# Altium schematic sheet Sheet3.SchDoc: Наименование
size 420 x 297 mm; ApprovedBy: Утвердил; CheckedBy: Проверил; Author: Разработал; CompanyName: Организация; DrawnBy: Н.Контр; Engineer: Т.Контр; SheetNumber: 1; SheetTotal: 1; PageSetup: Record=PageOptions|CenterHorizontal=True|CenterVertical=True|PrintScale=0.94|XCorrection=1.00|YCorrection=1.00|PrintKind=1|BorderSize=5000000|LeftOffset=0|BottomOffset=0|Orientation=1|PaperLength=1000|PaperWidth=1000|Scale=100|PaperSource=7|PrintQuality=-4|MediaType=1|DitherType=10|PaperKind=A4|PrintScaleMode=1; DecimalNumber: Децимальный номер; HeadOfSector: Нач. сектора; MainDevice: Перв.примен.; Name: Наименование; DocumentName: Sheet1.SCHDOC
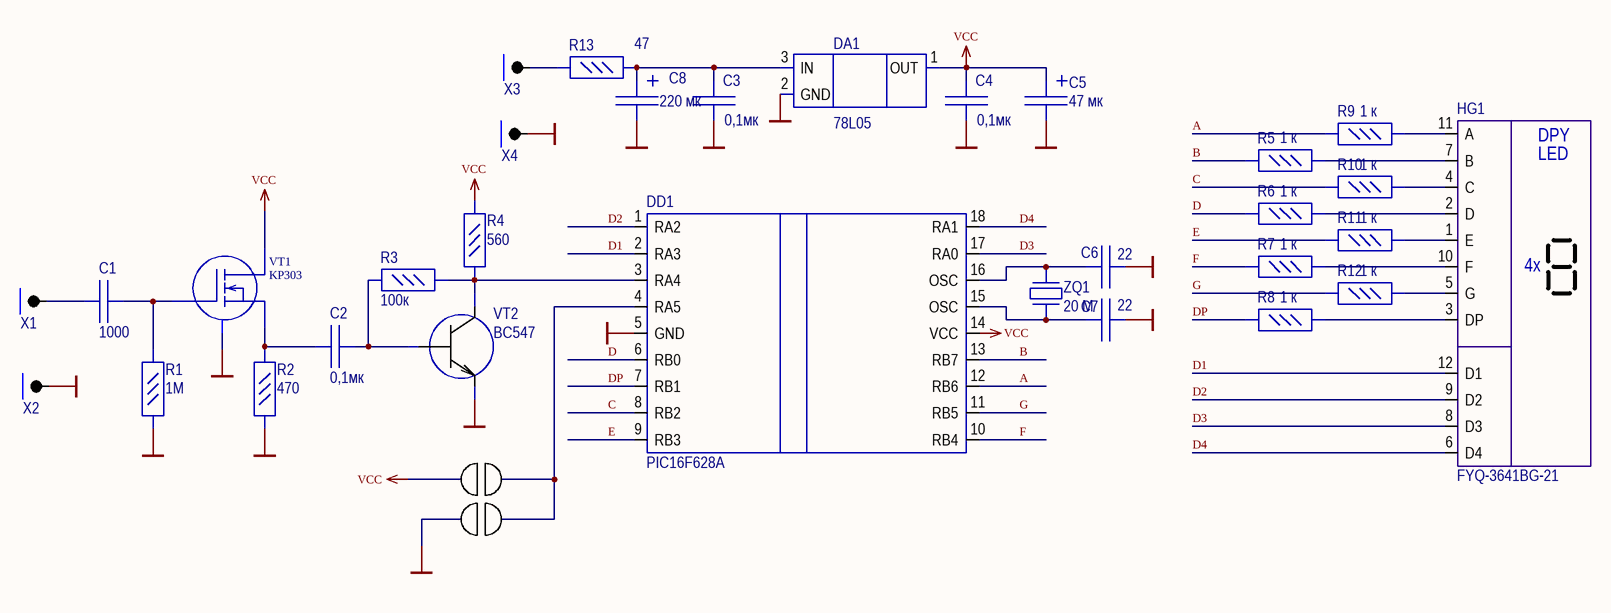
[diagram p0: Sheet3.SchDoc]

## Parts
C1  1000  [К10-17Б]
C2  0,1мк  [К10-17Б]
C3  0,1мк  [К10-17Б]
C4  0,1мк  [К10-17Б]
C5  47 мк  [К50-35]
C6  22  [К10-17Б]
C7  22  [К10-17Б]
C8  220 мк  [К50-35 - 8x11.5]
DA1  78L05  [КТ-26]
DD1  PIC16F628A  [DIP18]
HG1  FYQ-3641BG-21  [FYQ-3641]
R1  1М  [R_C1-4_V]
R2  470  [R_C1-4_V]
R3  100к  [R_C1-4_V]
R4  560  [R_C1-4_V]
R5  1 к  [R_C1-4_V]
R6  1 к  [R_C1-4_V]
R7  1 к  [R_C1-4_V]
R8  1 к  [R_C1-4_V]
R9  1 к  [R_C1-4_V]
R10  1 к  [R_C1-4_V]
R11  1 к  [R_C1-4_V]
R12  1 к  [R_C1-4_V]
R13  47  [R_C1-4_V]
VT1  KP303  [KP303]
VT2  BC547  [КТ-26]
X1  КТ  [KT]  (value not drawn)
X2  КТ  [KT]  (value not drawn)
X3  КТ  [KT]  (value not drawn)
X4  КТ  [KT]  (value not drawn)
X5  Solder_jumper  [Solder_jumper]  (value not drawn)
X6  Solder_jumper  [Solder_jumper]  (value not drawn)
ZQ1  20 M  [HC-49]

## Nets
GND: C3.1 C4.1 C5.2 C6.2 C7.2 C8.2 DA1.2(GND) DD1.5(GND) R1.1 R2.1 VT1.3 VT2.3(E) X2.1 X4.1 X6.1
VCC: C4.2 C5.1 DA1.1(OUT) DD1.14(VCC) R4.1 VT1.4(D) X5.1
A: DD1.12(RB6) R9.2
B: DD1.13(RB7) R5.2
C: DD1.8(RB2) R10.2
D: DD1.6(RB0) R6.2
D1: DD1.2(RA3) HG1.12(D1)
D2: DD1.1(RA2) HG1.9(D2)
D3: DD1.17(RA0) HG1.8(D3)
D4: DD1.18(RA1) HG1.6(D4)
DP: DD1.7(RB1) R8.2
E: DD1.9(RB3) R11.2
F: DD1.10(RB4) R7.2
G: DD1.11(RB5) R12.2
NetC1_1: C1.1 R1.2 VT1.1(G)
NetC1_2: C1.2 X1.1
NetC2_1: C2.1 R3.1 VT2.2(B)
NetC2_2: C2.2 R2.2 VT1.2(S)
NetC3_2: C3.2 C8.1 DA1.3(IN) R13.1
NetC6_1: C6.1 DD1.16(OSC) ZQ1.1
NetC7_1: C7.1 DD1.15(OSC) ZQ1.2
NetDD1_3: DD1.3(RA4) R3.2 R4.2 VT2.1(C)
NetDD1_4: DD1.4(RA5) X5.2 X6.2
NetHG1_1: HG1.1(E) R11.1
NetHG1_2: HG1.2(D) R6.1
NetHG1_3: HG1.3(DP) R8.1
NetHG1_4: HG1.4(C) R10.1
NetHG1_5: HG1.5(G) R12.1
NetHG1_7: HG1.7(B) R5.1
NetHG1_10: HG1.10(F) R7.1
NetHG1_11: HG1.11(A) R9.1
NetR13_2: R13.2 X3.1

## Notes on the sheet
- Перв.примен.
- Справ.№
- Подп. и дата
- Инв.№ дубл.
- Взам.инв.№
- Подп.и дата
- Разраб.
- Изм.
- Лист
- № докум.
- Подп.
- Дата
- Лит.
- Масштаб
- Масса
- Т.контр.
- Пров.
- СХЕМА   ЭЛЕКТРИЧЕСКАЯ
- ПРИНЦИПИАЛЬНАЯ
- Листов
- Инв.№ подл.
- Утв.
- Н.контр.
- Нач.сект.
- Формат  A3
- (in symbol FYQ-3641BG-21) DPY; LED; 4x

## Library data of the parts
C1-C4 C6 C7 = C_К10-17Б
C5 C8 = K50-35
DA1 = 78L06
DD1 = PIC16F628A: Manufacturer Part Number: TB6600HG(O); Manufacturer: Toshiba; Number Of Outputs: 4; Output Current: 4.5A; Switching Frequency: 200kHz; Max Power Dissipation: 3.2W; Motor Type: Stepper; Nominal Supply Current: 1.8-4.2mA; Standoff Height: 2.67mm; Max Supply Voltage: 42V; Min Supply Voltage: 8V; Device Class L1: Integrated Circuits (ICs); Digikey Description: IC MTR DRVR BIPOLAR 8-42V 25HZIP; ComponentLink2Description: Datasheet; Package: HZIP25-P-1.00F; RoHS: TRUE; Temperature Range Low: -30°C; Device Class L2: Power Management ICs; ComponentLink2URL: https://toshiba.semicon-storage.com/info/docget.jsp?did=14683&prodName=TB6600HG; Category: IC; Octopart: https://octopart.com/tb6600hg%28o%29-toshiba-24612481; Temperature Range High: +85°C; Temperature: -30°C to +85°C; Height: 19.87mm; Mouser Description: Motor / Motion / Ignition Controllers & Drivers 2-phase stepping motor Drvr 50V; Automotive: No; Lead Free: Yes; Device Class L3: Motor Drivers; Manufacturer 1: Toshiba; Manufacturer Part Number 1: TB6600HG(O)
HG1 = FYQ-3641BG-21: 4-х разр. светод. индикатор, зеленый, (ОА)
R1-R13 = R_C1-4
ZQ1 = HC-49